# Altium schematic sheet RECEPTION.SchDoc
size A4; SheetNumber: 3; SheetTotal: 3
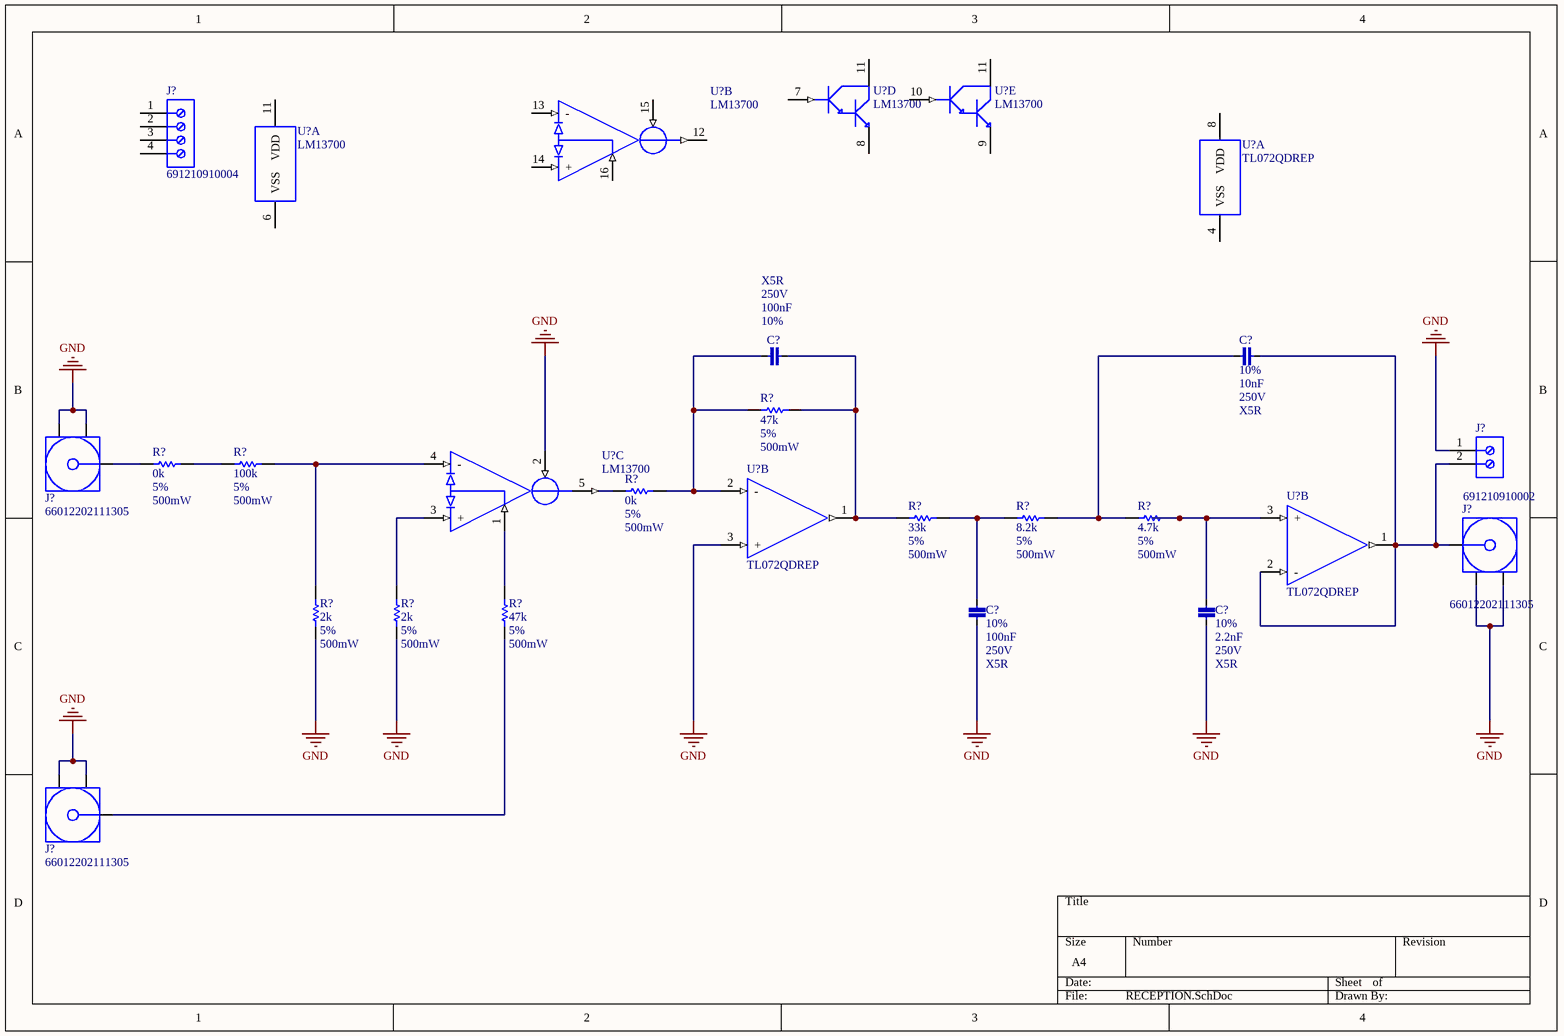
[diagram p0: RECEPTION.SchDoc]

## Parts
(Parts that share a designator on the sheet are numbered #1, #2 ... from top to bottom, then left to right.)
C?#1  value 100nF  Tol: 10%  Tension: 250V  Tech: X5R  [0805]  (hidden comment: Capacitor_15pF_250V_1%_X5R_0805)
C?#2  value 10nF  Tol: 10%  Tension: 250V  Tech: X5R  [0805]  (hidden comment: Capacitor_10nF_250V_10%_X5R_0805)
C?#3  value 100nF  Tol: 10%  Tension: 250V  Tech: X5R  [0805]  (hidden comment: Capacitor_100nF_250V_10%_X5R_0805)
C?#4  value 2.2nF  Tol: 10%  Tension: 250V  Tech: X5R  [0805]  (hidden comment: Capacitor_2.2nF_250V_10%_X5R_0805)
J?#1  Ref: 691210910004  [TerminalBlock_2.54mm_4p_691210910004]  (hidden comment: TERMINAL_BLOCK_4p_2.54mm_691210910004)
J?#2  Ref: 66012202111305  [MMCX_66012202111305]  (hidden comment: MMCX_66012202111305)
J?#3  Ref: 691210910002  [TerminalBlock_2.54mm_2p_691210910002]  (hidden comment: TERMINAL_BLOCK_2p_2.54mm_691210910002)
J?#4  Ref: 66012202111305  [MMCX_66012202111305]  (hidden comment: MMCX_66012202111305)
J?#5  Ref: 66012202111305  [MMCX_66012202111305]  (hidden comment: MMCX_66012202111305)
R?#1  value 47k  Tol: 5%  Power: 500mW  [0805_RES]  (hidden comment: Resistor_47k_5%_500mW_0805)
R?#2  value 0k  Tol: 5%  Power: 500mW  [0805_RES]  (hidden comment: Resistor_0k_5%_500mW_0805)
R?#3  value 100k  Tol: 5%  Power: 500mW  [0805_RES]  (hidden comment: Resistor_100k_5%_500mW_0805)
R?#4  value 0k  Tol: 5%  Power: 500mW  [0805_RES]  (hidden comment: Resistor_0k_5%_500mW_0805)
R?#5  value 33k  Tol: 5%  Power: 500mW  [0805_RES]  (hidden comment: Resistor_33k_5%_500mW_0805)
R?#6  value 8.2k  Tol: 5%  Power: 500mW  [0805_RES]  (hidden comment: Resistor_8.2k_5%_500mW_0805)
R?#7  value 4.7k  Tol: 5%  Power: 500mW  [0805_RES]  (hidden comment: Resistor_4.7k_5%_500mW_0805)
R?#8  value 2k  Tol: 5%  Power: 500mW  [0805_RES]  (hidden comment: Resistor_2k_5%_500mW_0805)
R?#9  value 2k  Tol: 5%  Power: 500mW  [0805_RES]  (hidden comment: Resistor_2k_5%_500mW_0805)
R?#10  value 47k  Tol: 5%  Power: 500mW  [0805_RES]  (hidden comment: Resistor_47k_5%_500mW_0805)
U?#1  LM13700  [SOIC16L]  (part D of 5)
U?#2  LM13700  [SOIC16L]  (part E of 5)
U?#3  LM13700  [SOIC16L]  (part B of 5)
U?#4  LM13700  [SOIC16L]  (part A of 5)
U?#5  Ref: TL072QDREP  [SOIC8]  (hidden comment: AOP_TL072QDREP)  (part A of 3)
U?#6  LM13700  [SOIC16L]  (part C of 5)
U?#7  Ref: TL072QDREP  [SOIC8]  (hidden comment: AOP_TL072QDREP)  (part B of 3)
U?#8  Ref: TL072QDREP  [SOIC8]  (hidden comment: AOP_TL072QDREP)  (part B of 3)

## Nets
GND: C?#3.2 C?#4.2 J?#2.2(GND) J?#2.3(GND) J?#3.1 J?#4.2(GND) J?#4.3(GND) J?#5.2(GND) J?#5.3(GND) R?#8.1 R?#9.1 U?#6.2 U?#7.3(+)
NetC?#1_1: C?#1.1 R?#1.1 R?#5.1 U?#7.1(outA)
NetC?#1_2: C?#1.2 R?#1.2 R?#4.2 U?#7.2(-)
NetC?#2_1: C?#2.1 R?#6.2 R?#7.1
NetC?#2_2: C?#2.2 J?#3.2 J?#4.1(Signal) U?#8.1(outA) U?#8.2(-)
NetC?#3_1: C?#3.1 R?#5.2 R?#6.1
NetC?#4_1: C?#4.1 R?#7.2 U?#8.3(+)
NetJ?#2_1: J?#2.1(Signal) R?#2.1
NetJ?#5_1: J?#5.1(Signal) R?#10.1
NetR?#2_2: R?#2.2 R?#3.1
NetR?#3_2: R?#3.2 R?#8.2 U?#6.4(-)
NetR?#9_2: R?#9.2 U?#6.3(+)
NetR?#10_2: R?#10.2 U?#6.1

Not connected (* = marked no-connect by the designer): J?#1 1 2 3 4; R?#4 1; U?#1 7 8 11(VDD); U?#2 9 10 11(VDD); U?#3 12(outA) 13(-) 14(+) 15 16; U?#4 6(VSS) 11(VDD); U?#5 4(VSS) 8(VDD); U?#6 5

## Library data of the parts
C?#1 = Capacitor_15pF_250V_1%_X5R_0805: Capacitor 15pF 250V 1% X5R 0805; Constructor: KEMET; Type: Passive; Ref: C0805C104K1RACTU; Supplier 1: Mouser; Supplier Part Number 1: 81-GRM21A5C2E150FW1D
C?#2 = Capacitor_10nF_250V_10%_X5R_0805: Capacitor 10nF 250V 10% X5R 0805; Constructor: KEMET; Type: Passive; Ref: C0805C104K1RACTU; Supplier 1: Arrow Electronics; Supplier Part Number 1: GRM21BR72E103KW03L
C?#3 = Capacitor_100nF_250V_10%_X5R_0805: Capacitor 100nF 250V 10% X5R 0805; Constructor: KEMET; Type: Passive; Ref: C0805C104K1RACTU; Supplier 1: Digi-Key; Supplier Part Number 1: 490-12005-1-ND
C?#4 = Capacitor_2.2nF_250V_10%_X5R_0805: Capacitor 2.2nF 250V 10% X5R 0805; Constructor: KEMET; Type: Passive; Ref: C0805C104K1RACTU; Supplier 1: Arrow Electronics; Supplier Part Number 1: GRM21AR72E222KW01D
J?#1 = TERMINAL_BLOCK_4p_2.54mm_691210910004: WR-TBL Series 2109 - 2.54 mm Horiz. Entry; Constructor: Wurth electronik; Type: Connector
J?#2 J?#4 J?#5 = MMCX_66012202111305: Connecteur MMCX  horizontal SMD; Constructor: Wurth; Type: Connector
J?#3 = TERMINAL_BLOCK_2p_2.54mm_691210910002: WR-TBL Series 2109 - 2.54 mm Horiz. Entry; Constructor: Wurth electronik; Type: Connector
R?#1 R?#10 = Resistor_47k_5%_500mW_0805: Resistor  47k 5% 500mW 0805; Constructor: Panasonic; Ref: CRCW080510K0FKEA; Voltage: 150V; Type: Vishay; Supplier 1: Digi-Key; Supplier Part Number 1: 511-SDR10EZPJ473CT-ND
R?#2 R?#4 = Resistor_0k_5%_500mW_0805: Resistor  0k 5% 500mW 0805; Constructor: Panasonic; Ref: CRCW080510K0FKEA; Voltage: 150V; Type: Vishay; Supplier 1: Digi-Key; Supplier Part Number 1: 511-PMR10EZPJ000CT-ND
R?#3 = Resistor_100k_5%_500mW_0805: Resistor  100k 5% 500mW 0805; Constructor: Panasonic; Ref: CRCW080510K0FKEA; Voltage: 150V; Type: Vishay; Supplier 1: Digi-Key; Supplier Part Number 1: 511-SDR10EZPD1003CT-ND
R?#5 = Resistor_33k_5%_500mW_0805: Resistor  33k 5% 500mW 0805; Constructor: Panasonic; Ref: CRCW080510K0FKEA; Voltage: 150V; Type: Vishay; Supplier 1: Digi-Key; Supplier Part Number 1: 511-SDR10EZPJ333CT-ND
R?#6 = Resistor_8.2k_5%_500mW_0805: Resistor  8.2k 5% 500mW 0805; Constructor: Panasonic; Ref: CRCW080510K0FKEA; Voltage: 150V; Type: Vishay; Supplier 1: Digi-Key; Supplier Part Number 1: 511-SFR10EZPF8201CT-ND
R?#7 = Resistor_4.7k_5%_500mW_0805: Resistor  4.7k 5% 500mW 0805; Constructor: Panasonic; Ref: CRCW080510K0FKEA; Voltage: 150V; Type: Vishay; Supplier 1: Digi-Key; Supplier Part Number 1: 511-SDR10EZPJ472CT-ND
R?#8 R?#9 = Resistor_2k_5%_500mW_0805: Resistor  2k 5% 500mW 0805; Constructor: Panasonic; Ref: CRCW080510K0FKEA; Voltage: 150V; Type: Vishay; Supplier 1: Digi-Key; Supplier Part Number 1: 511-SDR10EZPJ202CT-ND
U?#1-U?#4 U?#6 = OTA_LM13700: OTA; Constructor: Texas Instruments; Type: Semiconductors; Ref: LM13700
U?#5 U?#7 U?#8 = AOP_TL072QDREP: low noise Jfet input amplifier; Constructor: Texas Instruments; Type: Semiconductors